# EAGLE design LEDboard_v0.2-R002 (EAGLE 6.5.0)
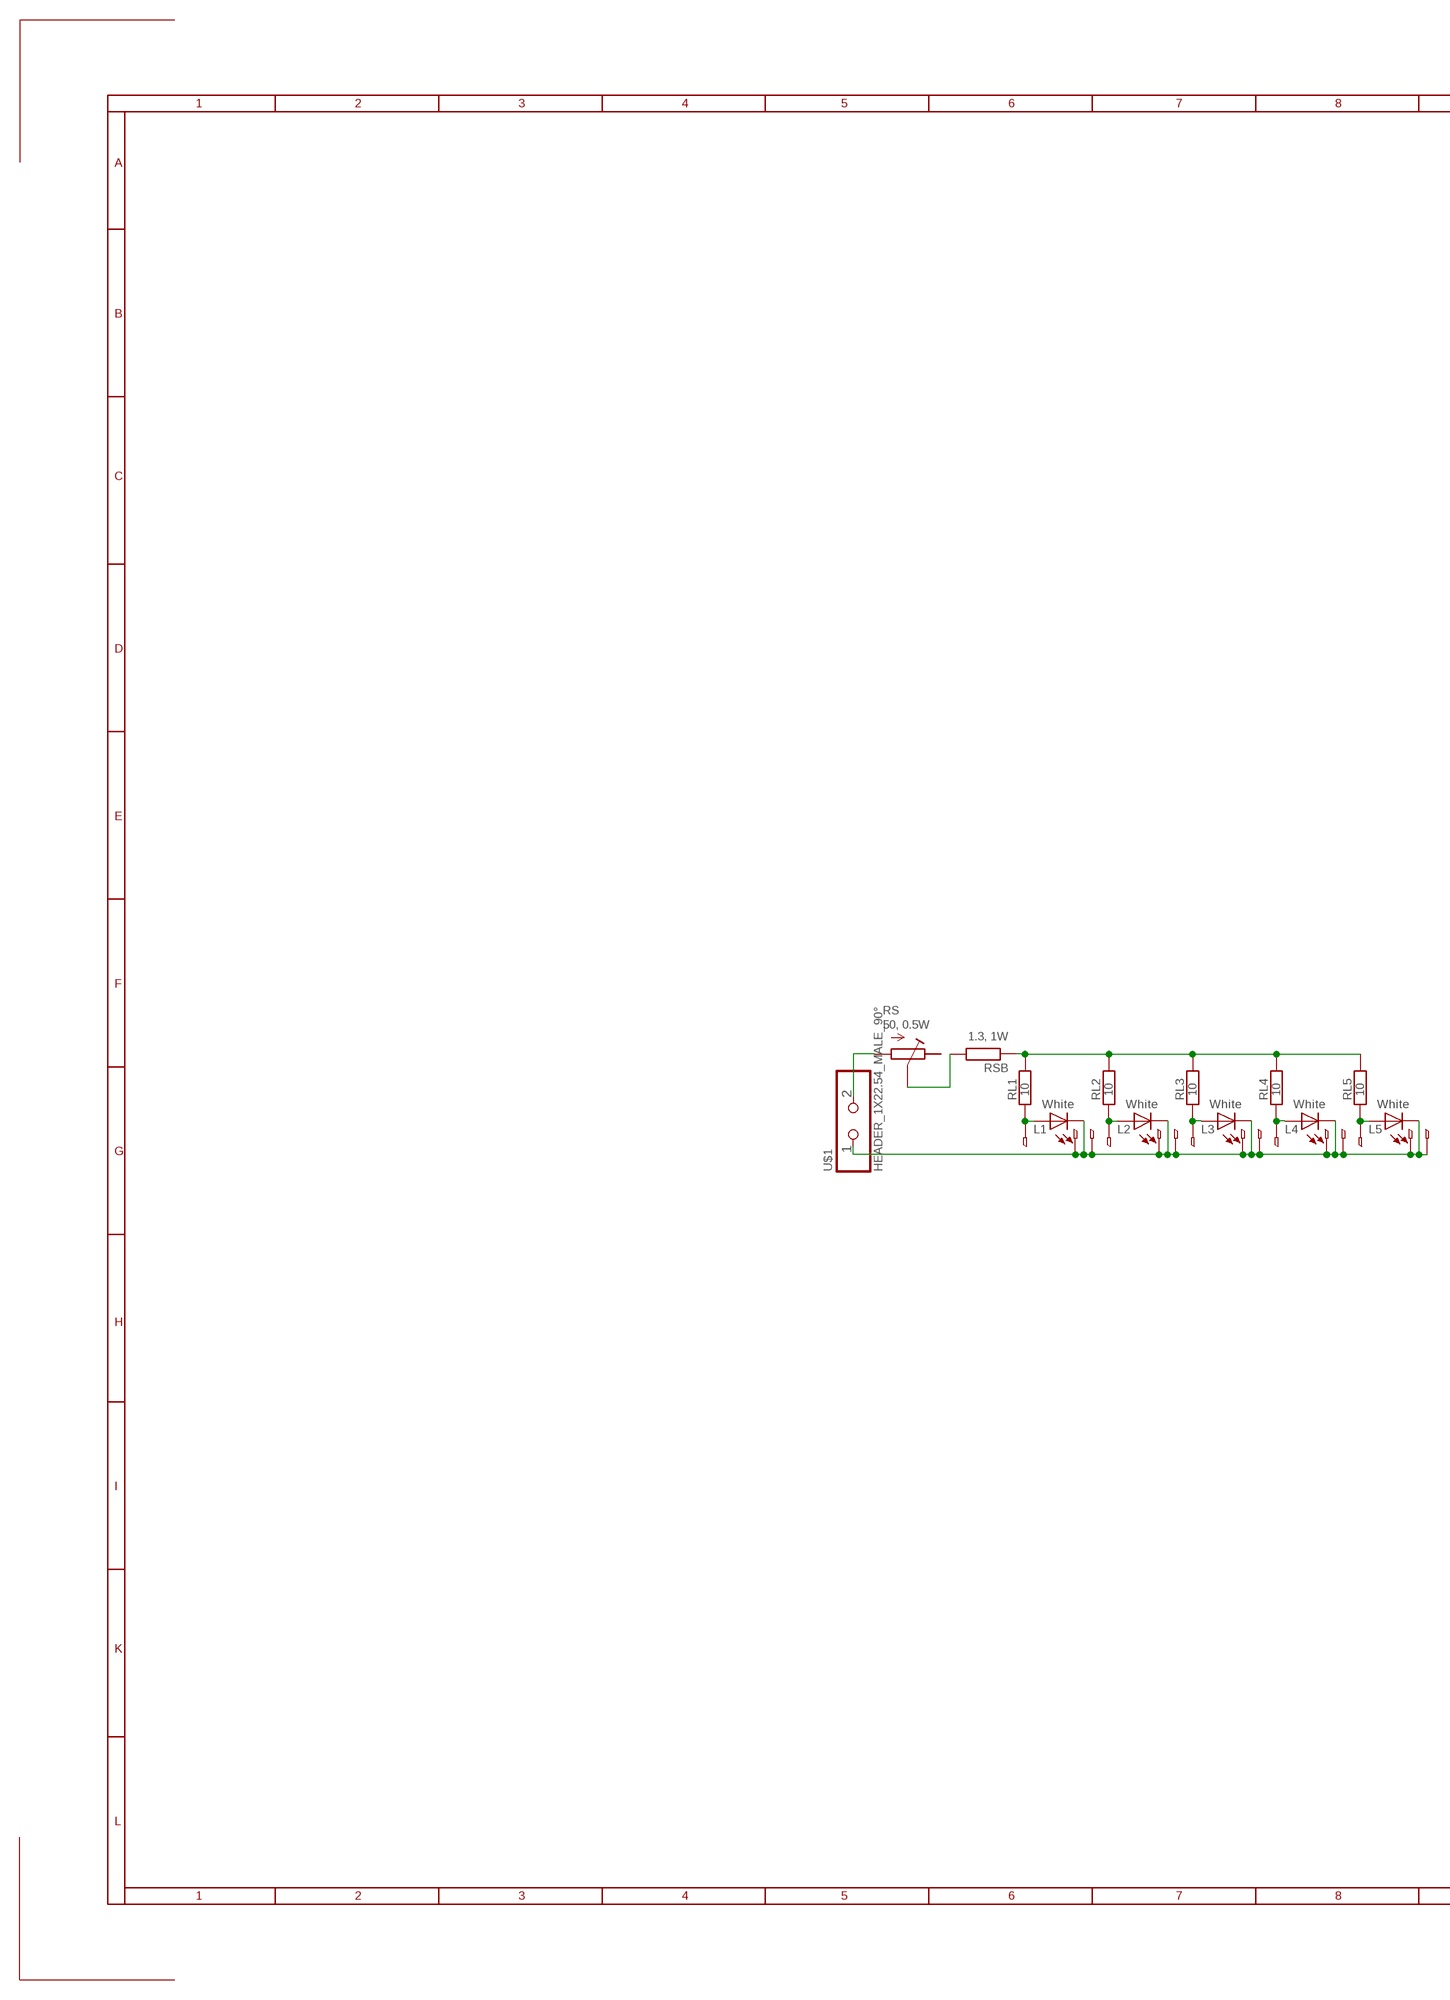
[diagram p0: schematic, sheet 1, part 1 of 2]
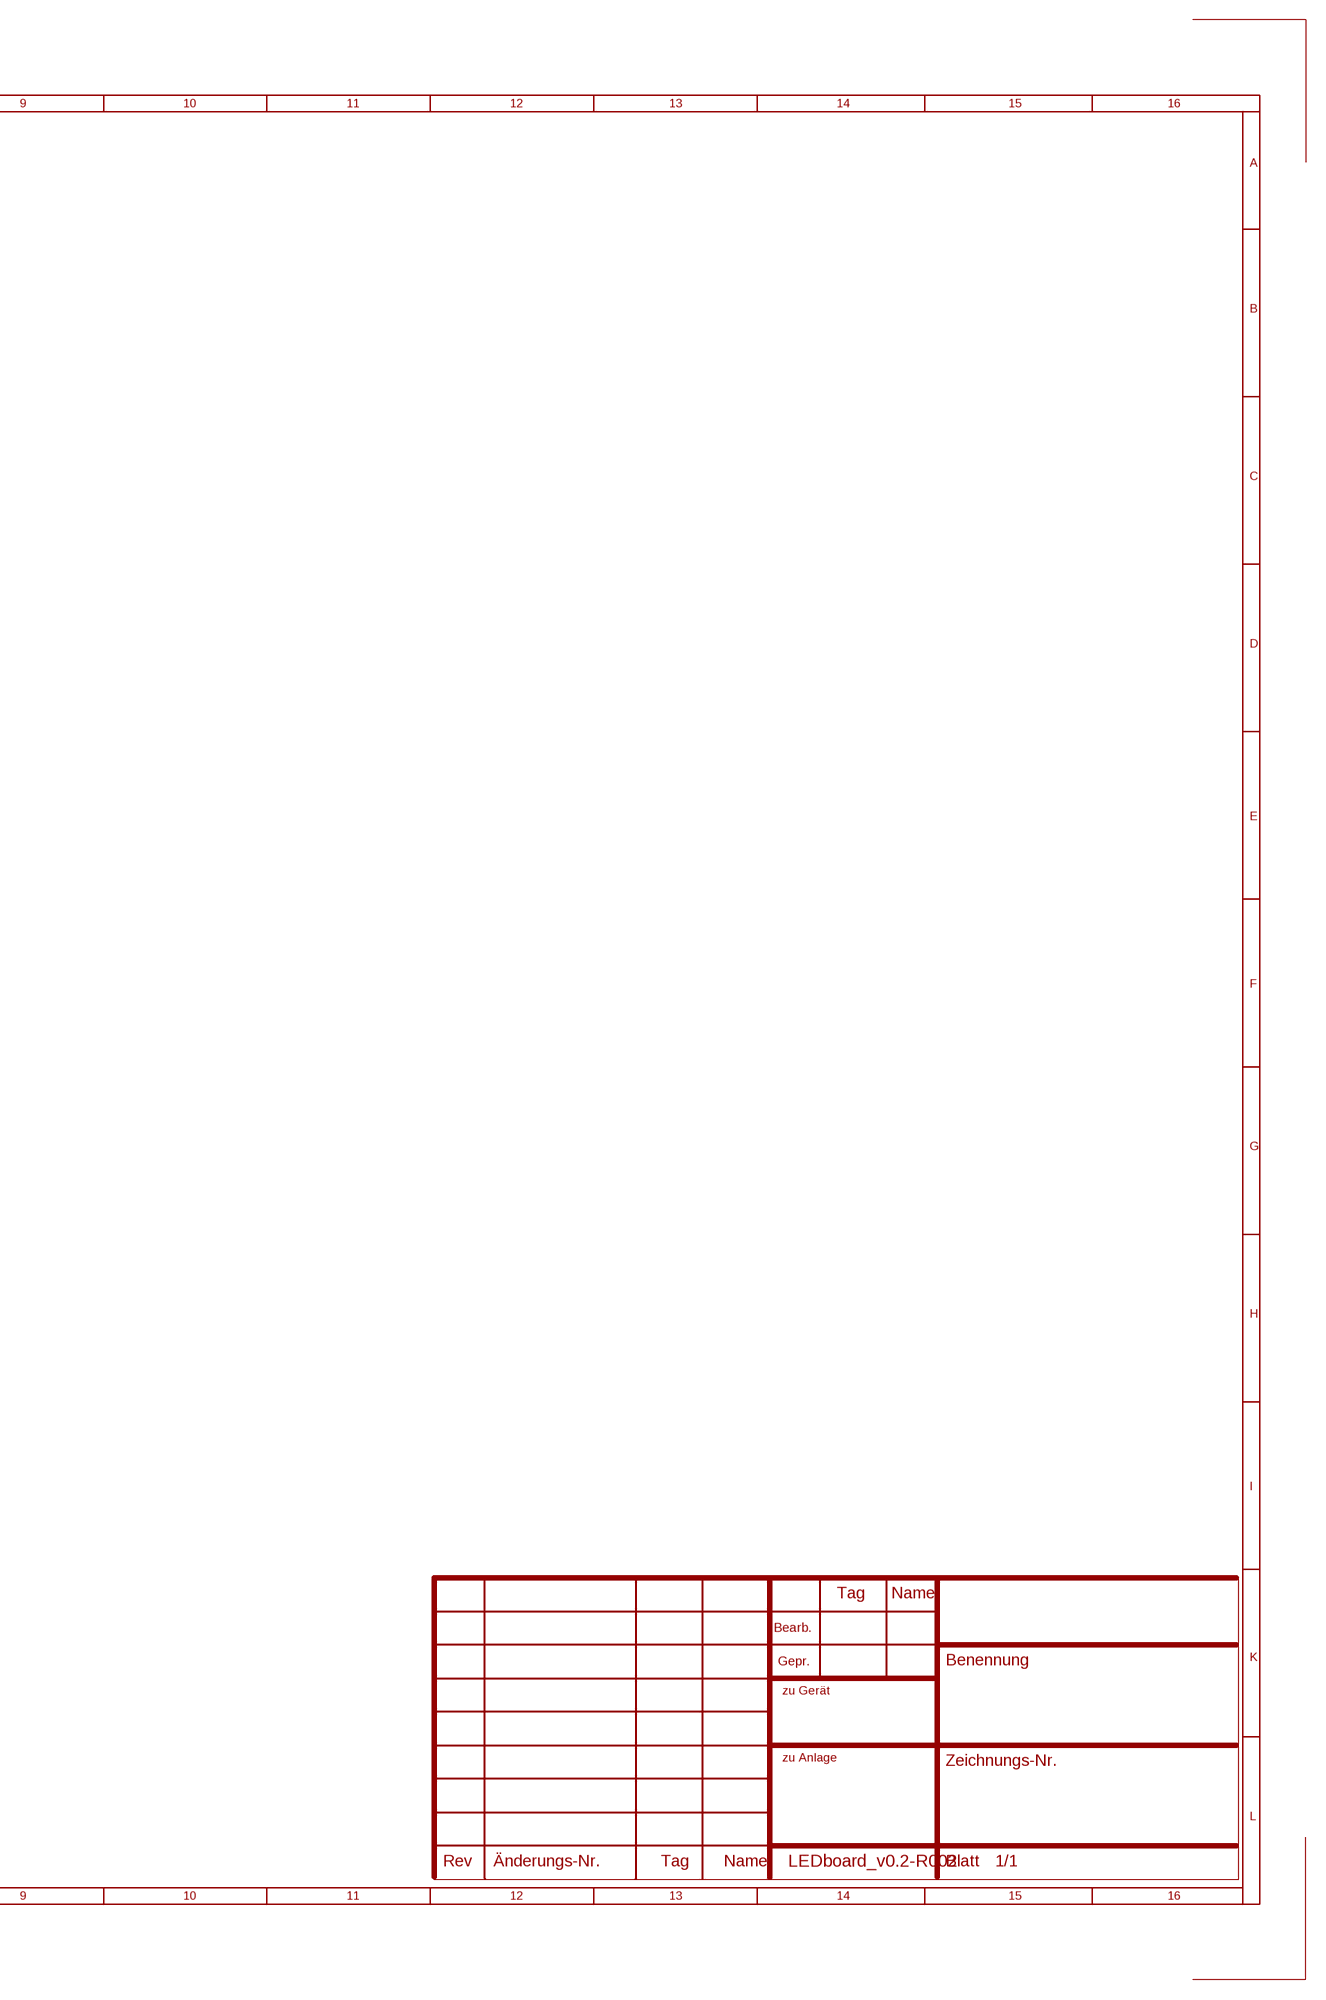
[diagram p1: schematic, sheet 1, part 2 of 2]

## Parts
L1  White  LED_LM561B  [LED_LM561B]
L2  White  LED_LM561B  [LED_LM561B]
L3  White  LED_LM561B  [LED_LM561B]
L4  White  LED_LM561B  [LED_LM561B]
L5  White  LED_LM561B  [LED_LM561B]
RL1  10  R-EU_R0805  [R0805]
RL2  10  R-EU_R0805  [R0805]
RL3  10  R-EU_R0805  [R0805]
RL4  10  R-EU_R0805  [R0805]
RL5  10  R-EU_R0805  [R0805]
RS  50, 0.5W  R-TRIMM3290H  [RTRIM3290H]
RSB  1.3, 1W  R-EU_0207/10  [0207/10]
U$1  HEADER_1X22.54_MALE_90°  [1X02_2.54_90]

## Nets
0V: L1.C1(C) L1.C2 L1.C3 L2.C1(C) L2.C2 L2.C3 L3.C1(C) L3.C2 L3.C3 L4.C1(C) L4.C2 L4.C3 L5.C1(C) L5.C2 L5.C3 U$1.1
N$1: RS.2(S) RSB.2
N$2: RL1.2 RL2.2 RL3.2 RL4.2 RL5.2 RSB.1
N$3: L1.A1(A) L1.A2 RL1.1
N$4: L2.A1(A) L2.A2 RL2.1
N$5: L5.A1(A) L5.A2 RL5.1
N$6: L4.A1(A) L4.A2 RL4.1
N$7: L3.A1(A) L3.A2 RL3.1
N$8: RS.1(E) U$1.2
Unconnected: RS.3(A)

## Library data of the parts
L1-L5 = ICST:LED_LM561B
RL1-RL5 RSB = SABRe:R-EU_: RESISTOR, European symbol
RS = SABRe:R-TRIMM: Trimm resistor
U$1 = SABRe:HEADER_1X2

## Board
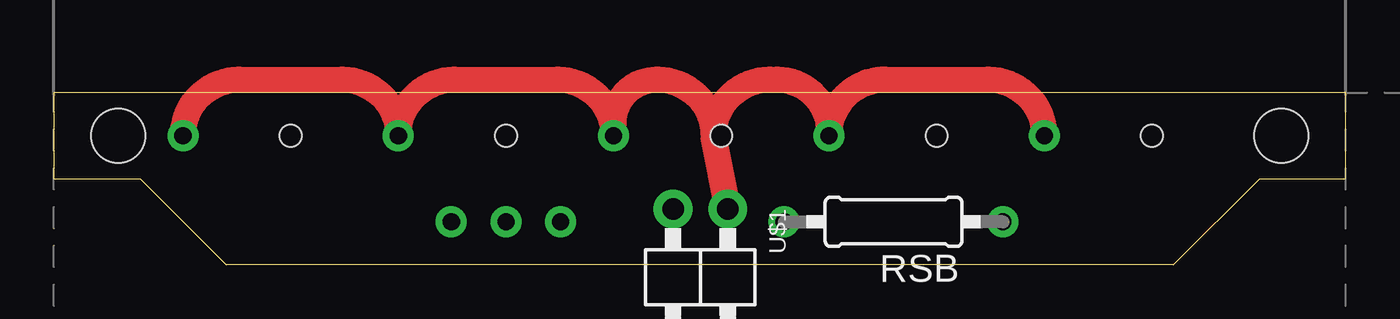
[diagram p2: board, top side]
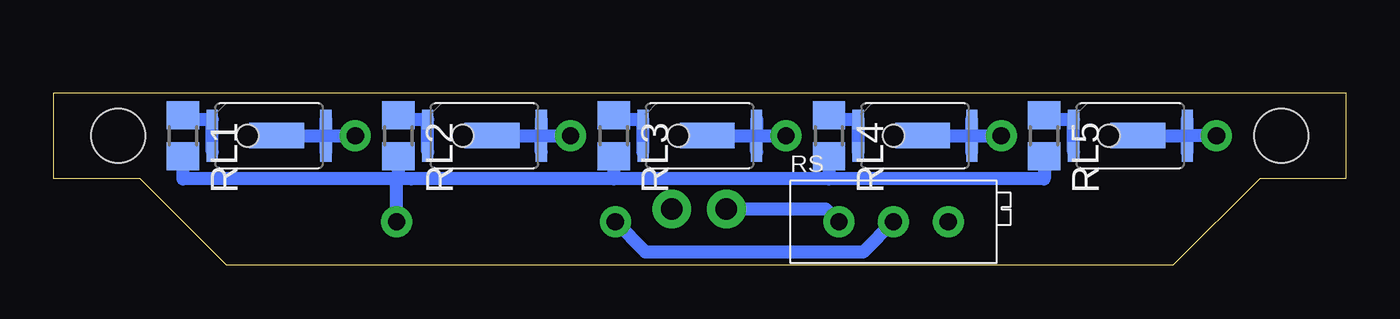
[diagram p3: board, bottom side, seen from below]

Size 60 x 8 mm. Coordinates in mm from the lower left corner, seen from the top.
Outline: 0,4 4,4 8,0 52,0 56,4 60,4 60,8 0,8 0,4
Copper layers (1*16): Top 0mil / dielectric 0.8mm / Bottom 0.035mm
Design rules "ICST_gravur": minimum track width 0.4mm, minimum drill 0.4mm, track to track 0.15mm, track to pad 0.15mm, pad to pad 0.15mm, via to via 0.15mm, smd to smd 0mil, copper to edge 0.2mm, drill to drill 0.2mm, minimum pad ring 0.1mm, minimum via ring 0.1mm, stop-mask expansion 0.15mm, vias tented up to drill 0.3mm, thermal gap 0.25mm
Holes 2.5 mm at 3,6 57,6
Holes 1 mm at 11,6 21,6 31,6 41,6 51,6

### Footprints (pad centres in the part's own frame; a part is rotated, then mirrored left to right if it is on the bottom)
LED_LM561B = smd 0.52 x 0.9: A1 -2.64,0.75; A2 -2.64,-0.75; C1 2.64,0.75; C2 2.64,-0.75 | smd 2.54 x 1.18: C3 0.35,0
R0805 = smd 1.3 x 1.5: 1 -0.95,0; 2 0.95,0
RTRIM3290H = drill 0.8: 1 0,-2.54; 2 0,0; 3 0,2.54
0207/10 = drill 0.8: 1 -5.08,0; 2 5.08,0
1X02_2.54_90 = drill 1: 1 0,0; 2 2.54,0

### Placement (x,y rotation side)
L1  50,6 0 bottom
L2  40,6 0 bottom
L3  30,6 0 bottom
L4  20,6 0 bottom
L5  10,6 0 bottom
RL1  54,6 270 bottom
RL2  44,6 270 bottom
RL3  34,6 270 bottom
RL4  24,6 270 bottom
RL5  14,6 270 bottom
RS  21,2 270 bottom
RSB  39,2 180 top
U$1  31.3,2.6 180 top

### Tracks (layer width: path | path; a pad name or v marks a point on that pad's centre or on a via)
0V  (via drill 0.8)
  Top 1.2: v6,6 arc-90 8.6,8.6 13.4,8.6 arc-90 v16,6 arc-90 18.6,8.6 23.4,8.6 arc-90 v26,6 26,6.6 arc-90 28,8.6 28.05,8.6 arc-90 30.64,6 | 30.64,6 arc-90 33.24,8.6 33.6,8.6 arc-90 36,6.2 v36,6 arc-90 38.6,8.6 43.4,8.6 arc-90 v46,6 | U$1.1 30.64,6
  Bottom 0.6: L5.C2 7.36,6 | 7.36,6 L5.C1 | L5.C3 7.36,6 | L4.C2 17.36,6 | 17.36,6 L4.C1 | L4.C3 17.36,6 | L3.C2 27.36,6 | L3.C3 27.36,6 | L2.C2 37.36,6 | L2.C3 37.36,6 | L1.C2 47.36,6 | 47.36,6 L1.C1 | L1.C3 47.36,6 | v6,6 7.36,6 | 17.36,6 v16,6 | 27.36,6 v26,6 | L3.C1 27.36,6 | 37.36,6 v36,6 | 47.36,6 v46,6 | L2.C1 37.36,6
N$1
  Bottom 0.6: RS.2 22.4,0.6 32.52,0.6 RSB.2
N$2
  Bottom 0.6: RL2.2 44,4 | 44,4 54,4 RL1.2 | RL3.2 34,4 | 34,4 43.4,4 44,4 | RL4.2 24,4 | 24,4 34,4 | RL5.2 14,4 24,4 | RSB.1 44.08,4 44,4
N$3
  Bottom 0.6: L1.A2 L1.A1 54,6.75 RL1.1
N$4
  Bottom 0.6: L2.A2 L2.A1 44,6.75 RL2.1
N$5
  Bottom 0.6: L5.A2 L5.A1 14,6.75 RL5.1
N$6
  Bottom 0.6: L4.A2 L4.A1 24,6.75 RL4.1
N$7
  Bottom 0.6: L3.A2 L3.A1 34,6.75 RL3.1
N$8
  Bottom 0.6: U$1.2 24.14,2.6 RS.1

### Text on the board
tDocu: Plexiglas dimension